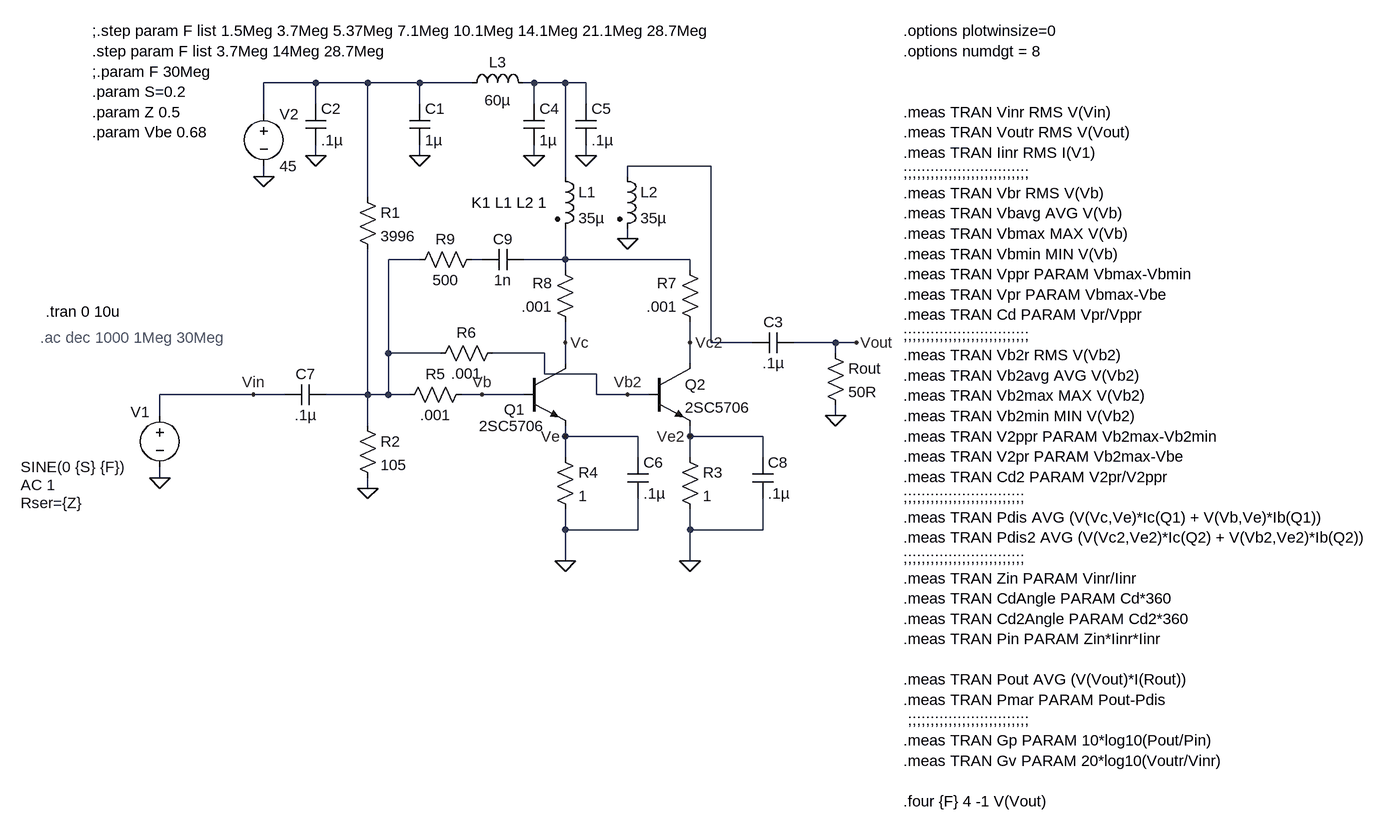
[diagram p0: schematic 2sc5706 (Dual) 10W.asc]
2sc5706 (Dual) 10W.asc, the LTspice schematic file:
Version 4
SHEET 1 1708 1496
WIRE 32 -288 -48 -288
WIRE 112 -288 32 -288
WIRE 192 -288 112 -288
WIRE 272 -288 192 -288
WIRE 368 -288 352 -288
WIRE 416 -288 368 -288
WIRE 448 -288 416 -288
WIRE 32 -256 32 -288
WIRE 192 -256 192 -288
WIRE 368 -256 368 -288
WIRE 448 -256 448 -288
WIRE -48 -240 -48 -288
WIRE 32 -176 32 -192
WIRE 192 -176 192 -192
WIRE 368 -176 368 -192
WIRE 448 -176 448 -192
WIRE 640 -160 512 -160
WIRE -48 -144 -48 -160
WIRE 416 -144 416 -288
WIRE 512 -144 512 -160
WIRE 112 -112 112 -288
WIRE 512 -48 512 -64
WIRE 192 -16 144 -16
WIRE 288 -16 272 -16
WIRE 416 -16 416 -64
WIRE 416 -16 352 -16
WIRE 608 -16 416 -16
WIRE 416 0 416 -16
WIRE 608 0 608 -16
WIRE 416 112 416 80
WIRE 608 112 608 80
WIRE 640 112 640 -160
WIRE 704 112 640 112
WIRE 832 112 768 112
WIRE 864 112 832 112
WIRE 144 128 144 -16
WIRE 224 128 144 128
WIRE 384 128 304 128
WIRE 832 128 832 112
WIRE 416 144 416 112
WIRE 608 144 608 112
WIRE 384 160 384 128
WIRE 464 160 384 160
WIRE -64 192 -208 192
WIRE -16 192 -64 192
WIRE 112 192 112 -32
WIRE 112 192 48 192
WIRE 144 192 144 128
WIRE 144 192 112 192
WIRE 176 192 144 192
WIRE 288 192 256 192
WIRE 352 192 288 192
WIRE 464 192 464 160
WIRE 512 192 464 192
WIRE 544 192 512 192
WIRE -208 224 -208 192
WIRE 832 224 832 208
WIRE 112 240 112 192
WIRE 416 256 416 240
WIRE 528 256 416 256
WIRE 608 256 608 240
WIRE 720 256 608 256
WIRE 416 288 416 256
WIRE 528 288 528 256
WIRE 608 288 608 256
WIRE 720 288 720 256
WIRE -208 320 -208 304
WIRE 112 336 112 320
WIRE 416 400 416 368
WIRE 528 400 528 352
WIRE 528 400 416 400
WIRE 608 400 608 368
WIRE 720 400 720 352
WIRE 720 400 608 400
WIRE 416 448 416 400
WIRE 608 448 608 400
FLAG 192 -176 0
FLAG 32 -176 0
FLAG -48 -144 0
FLAG -208 320 0
FLAG 112 336 0
FLAG 416 448 0
FLAG 864 112 Vout
FLAG 832 224 0
FLAG 368 -176 0
FLAG 448 -176 0
FLAG 288 192 Vb
FLAG 416 256 Ve
FLAG -64 192 Vin
FLAG 416 112 Vc
FLAG 512 -48 0
FLAG 608 448 0
FLAG 608 256 Ve2
FLAG 512 192 Vb2
FLAG 608 112 Vc2
SYMBOL npn 352 144 R0
WINDOW 0 -30 71 Left 2
WINDOW 3 -69 96 Left 2
SYMATTR InstName Q1
SYMATTR Value 2SC5706
SYMBOL voltage -208 208 R0
WINDOW 0 -45 11 Left 2
WINDOW 3 -214 95 Left 2
WINDOW 123 -214 123 Left 2
WINDOW 39 -214 151 Left 2
SYMATTR InstName V1
SYMATTR Value SINE(0 {S} {F})
SYMATTR Value2 AC 1
SYMATTR SpiceLine Rser={Z}
SYMBOL voltage -48 -256 R0
WINDOW 123 0 0 Left 0
WINDOW 39 0 0 Left 0
SYMATTR InstName V2
SYMATTR Value 45
SYMBOL res 96 -128 R0
SYMATTR InstName R1
SYMATTR Value 3996
SYMBOL res 96 224 R0
SYMATTR InstName R2
SYMATTR Value 105
SYMBOL res 400 272 R0
SYMATTR InstName R4
SYMATTR Value 1
SYMBOL cap 176 -256 R0
SYMATTR InstName C1
SYMATTR Value 1µ
SYMBOL cap 16 -256 R0
SYMATTR InstName C2
SYMATTR Value .1µ
SYMBOL cap 768 96 R90
WINDOW 0 0 32 VBottom 2
WINDOW 3 32 32 VTop 2
SYMATTR InstName C3
SYMATTR Value .1µ
SYMBOL ind2 400 -160 R0
SYMATTR InstName L1
SYMATTR Value 35µ
SYMATTR Type ind
SYMBOL res 816 112 R0
SYMATTR InstName Rout
SYMATTR Value 50R
SYMBOL ind 256 -272 R270
WINDOW 0 32 56 VTop 2
WINDOW 3 5 56 VBottom 2
SYMATTR InstName L3
SYMATTR Value 60µ
SYMBOL cap 352 -256 R0
SYMATTR InstName C4
SYMATTR Value 1µ
SYMBOL cap 432 -256 R0
SYMATTR InstName C5
SYMATTR Value .1µ
SYMBOL cap 48 176 R90
WINDOW 0 0 32 VBottom 2
WINDOW 3 32 32 VTop 2
SYMATTR InstName C7
SYMATTR Value .1µ
SYMBOL cap 512 288 R0
SYMATTR InstName C6
SYMATTR Value .1µ
SYMBOL ind2 496 -160 R0
SYMATTR InstName L2
SYMATTR Value 35µ
SYMATTR Type ind
SYMBOL npn 544 144 R0
SYMATTR InstName Q2
SYMATTR Value 2SC5706
SYMBOL res 592 272 R0
SYMATTR InstName R3
SYMATTR Value 1
SYMBOL cap 704 288 R0
SYMATTR InstName C8
SYMATTR Value .1µ
SYMBOL res 272 176 R90
WINDOW 0 0 56 VBottom 2
WINDOW 3 32 56 VTop 2
SYMATTR InstName R5
SYMATTR Value .001
SYMBOL res 320 112 R90
WINDOW 0 0 56 VBottom 2
WINDOW 3 32 56 VTop 2
SYMATTR InstName R6
SYMATTR Value .001
SYMBOL res 624 96 R180
WINDOW 0 36 76 Left 2
WINDOW 3 36 40 Left 2
SYMATTR InstName R7
SYMATTR Value .001
SYMBOL res 432 96 R180
WINDOW 0 36 76 Left 2
WINDOW 3 36 40 Left 2
SYMATTR InstName R8
SYMATTR Value .001
SYMBOL cap 352 -32 R90
WINDOW 0 0 32 VBottom 2
WINDOW 3 32 32 VTop 2
SYMATTR InstName C9
SYMATTR Value 1n
SYMBOL res 288 -32 R90
WINDOW 0 0 56 VBottom 2
WINDOW 3 32 56 VTop 2
SYMATTR InstName R9
SYMATTR Value 500
TEXT -384 64 Left 2 !.tran 0 10u
TEXT 936 -368 Left 2 !.options plotwinsize=0\n.options numdgt = 8\n \n \n.meas TRAN Vinr RMS V(Vin)\n.meas TRAN Voutr RMS V(Vout)\n.meas TRAN Iinr RMS I(V1)\n;;;;;;;;;;;;;;;;;;;;;;;;;;;;\n.meas TRAN Vbr RMS V(Vb)\n.meas TRAN Vbavg AVG V(Vb)\n.meas TRAN Vbmax MAX V(Vb)\n.meas TRAN Vbmin MIN V(Vb)\n.meas TRAN Vppr PARAM Vbmax-Vbmin\n.meas TRAN Vpr PARAM Vbmax-Vbe\n.meas TRAN Cd PARAM Vpr/Vppr\n;;;;;;;;;;;;;;;;;;;;;;;;;;;;\n.meas TRAN Vb2r RMS V(Vb2)\n.meas TRAN Vb2avg AVG V(Vb2)\n.meas TRAN Vb2max MAX V(Vb2)\n.meas TRAN Vb2min MIN V(Vb2)\n.meas TRAN V2ppr PARAM Vb2max-Vb2min\n.meas TRAN V2pr PARAM Vb2max-Vbe\n.meas TRAN Cd2 PARAM V2pr/V2ppr\n;;;;;;;;;;;;;;;;;;;;;;;;;;;\n.meas TRAN Pdis AVG (V(Vc,Ve)*Ic(Q1) + V(Vb,Ve)*Ib(Q1))\n.meas TRAN Pdis2 AVG (V(Vc2,Ve2)*Ic(Q2) + V(Vb2,Ve2)*Ib(Q2))\n;;;;;;;;;;;;;;;;;;;;;;;;;;;\n.meas TRAN Zin PARAM Vinr/Iinr \n.meas TRAN CdAngle PARAM Cd*360\n.meas TRAN Cd2Angle PARAM Cd2*360\n.meas TRAN Pin PARAM Zin*Iinr*Iinr \n \n.meas TRAN Pout AVG (V(Vout)*I(Rout))\n.meas TRAN Pmar PARAM Pout-Pdis\n ;;;;;;;;;;;;;;;;;;;;;;;;;;;\n.meas TRAN Gp PARAM 10*log10(Pout/Pin)\n.meas TRAN Gv PARAM 20*log10(Voutr/Vinr)\n \n.four {F} 4 -1 V(Vout)
TEXT -312 -368 Left 2 !;.step param F list 1.5Meg 3.7Meg 5.37Meg 7.1Meg 10.1Meg 14.1Meg 21.1Meg 28.7Meg\n.step param F list 3.7Meg 14Meg 28.7Meg\n;.param F 30Meg\n.param S=0.2\n.param Z 0.5\n.param Vbe 0.68
TEXT 272 -104 Left 2 !K1 L1 L2 1
TEXT -392 104 Left 2 ;.ac dec 1000 1Meg 30Meg

The netlist it stands for:
* 2sc5706 (Dual) 10W.asc
Q1 Vc Vb Ve 0 2SC5706
V1 Vin 0 SINE(0 {S} {F}) AC 1 Rser={Z}
V2 N001 0 45
R1 N001 N004 3996
R2 N004 0 105
R4 Ve 0 1
C1 N001 0 1µ
C2 N001 0 .1µ
C3 Vout N003 .1µ
L1 N002 N006 35µ
Rout Vout 0 50R
L3 N001 N002 60µ
C4 N002 0 1µ
C5 N002 0 .1µ
C7 N004 Vin .1µ
C6 Ve 0 .1µ
L2 N003 0 35µ
Q2 Vc2 Vb2 Ve2 0 2SC5706
R3 Ve2 0 1
C8 Ve2 0 .1µ
R5 Vb N004 .001
R6 Vb2 N004 .001
R7 Vc2 N006 .001
R8 Vc N006 .001
C9 N006 N005 1n
R9 N005 N004 500
.model NPN NPN
.model PNP PNP
.lib standard.bjt
.tran 0 10u
.options plotwinsize=0
.options numdgt = 8
.meas TRAN Vinr RMS V(Vin)
.meas TRAN Voutr RMS V(Vout)
.meas TRAN Iinr RMS I(V1)
;;;;;;;;;;;;;;;;;;;;;;;;;;;;
.meas TRAN Vbr RMS V(Vb)
.meas TRAN Vbavg AVG V(Vb)
.meas TRAN Vbmax MAX V(Vb)
.meas TRAN Vbmin MIN V(Vb)
.meas TRAN Vppr PARAM Vbmax-Vbmin
.meas TRAN Vpr PARAM Vbmax-Vbe
.meas TRAN Cd PARAM Vpr/Vppr
;;;;;;;;;;;;;;;;;;;;;;;;;;;;
.meas TRAN Vb2r RMS V(Vb2)
.meas TRAN Vb2avg AVG V(Vb2)
.meas TRAN Vb2max MAX V(Vb2)
.meas TRAN Vb2min MIN V(Vb2)
.meas TRAN V2ppr PARAM Vb2max-Vb2min
.meas TRAN V2pr PARAM Vb2max-Vbe
.meas TRAN Cd2 PARAM V2pr/V2ppr
;;;;;;;;;;;;;;;;;;;;;;;;;;;
.meas TRAN Pdis AVG (V(Vc,Ve)*Ic(Q1) + V(Vb,Ve)*Ib(Q1))
.meas TRAN Pdis2 AVG (V(Vc2,Ve2)*Ic(Q2) + V(Vb2,Ve2)*Ib(Q2))
;;;;;;;;;;;;;;;;;;;;;;;;;;;
.meas TRAN Zin PARAM Vinr/Iinr
.meas TRAN CdAngle PARAM Cd*360
.meas TRAN Cd2Angle PARAM Cd2*360
.meas TRAN Pin PARAM Zin*Iinr*Iinr
.meas TRAN Pout AVG (V(Vout)*I(Rout))
.meas TRAN Pmar PARAM Pout-Pdis
 ;;;;;;;;;;;;;;;;;;;;;;;;;;;
.meas TRAN Gp PARAM 10*log10(Pout/Pin)
.meas TRAN Gv PARAM 20*log10(Voutr/Vinr)
.four {F} 4 -1 V(Vout)
;.step param F list 1.5Meg 3.7Meg 5.37Meg 7.1Meg 10.1Meg 14.1Meg 21.1Meg 28.7Meg
.step param F list 3.7Meg 14Meg 28.7Meg
;.param F 30Meg
.param S=0.2
.param Z 0.5
.param Vbe 0.68
K1 L1 L2 1
* .ac dec 1000 1Meg 30Meg
.backanno
.end